# Altium schematic sheet WallLightRemote_V1.0_MCU.SchDoc: WallLight Remote
size A4; PageSetup: Record=PageOptions|CenterHorizontal=True|CenterVertical=True|PrintScale=0.97|XCorrection=1.00|YCorrection=1.00|PrintKind=0|BorderSize=5000000|LeftOffset=0|BottomOffset=0|Orientation=2|PaperLength=1000|PaperWidth=1000|Scale=100|PaperSource=7|PrintQuality=-3|MediaType=1|DitherType=10|PrintScaleMode=1|PaperKind=A4|PaperIndex=9; Organization: Crelin; Address1: Karl-Neuhaus-Strasse 6, 2502 Biel; Address2: Florian Baumgartner; Address3: florian.b-h@bluewin.ch; Address4: Tel: (+41) 32-323 56 25 / (+41) 79-502 92 10; DocumentNumber: MCU; Revision: V1.0; SheetNumber: 2; SheetTotal: 5; Author: Florian Baumgartner
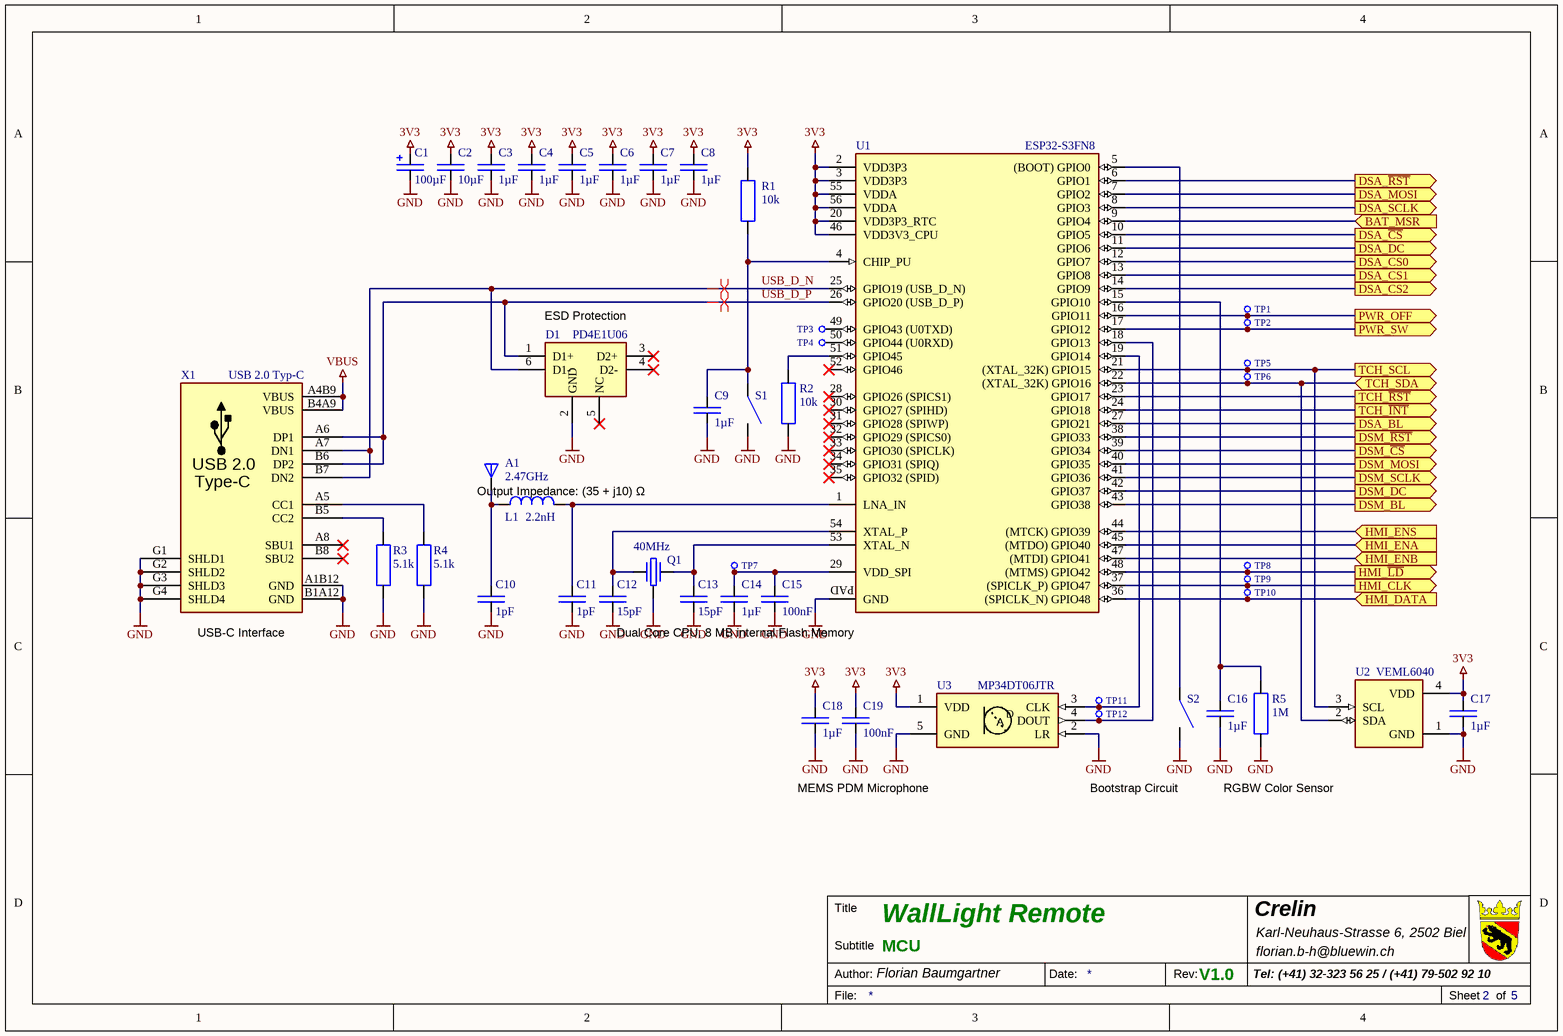
[diagram p0: WallLightRemote_V1.0_MCU.SchDoc]

## Parts
A1  2.47GHz  [SMD Chip-Antenna 7020 (SLDA72-2R470G-S1TF)]
C1  100µF  [SMD Tantalkondensator 1210 +]
C2  10µF  [SMD Keramikkondensator 1206]
C3  1µF  [SMD Keramikkondensator 0603]
C4  1µF  [SMD Keramikkondensator 0603]
C5  1µF  [SMD Keramikkondensator 0603]
C6  1µF  [SMD Keramikkondensator 0603]
C7  1µF  [SMD Keramikkondensator 0603]
C8  1µF  [SMD Keramikkondensator 0603]
C9  1µF  [SMD Keramikkondensator 0603]
C10  1pF  [SMD Keramikkondensator 0402]
C11  1pF  [SMD Keramikkondensator 0402]
C12  15pF  [SMD Keramikkondensator 0603]
C13  15pF  [SMD Keramikkondensator 0603]
C14  1µF  [SMD Keramikkondensator 0603]
C15  100nF  [SMD Keramikkondensator 0603]
C16  1µF  [SMD Keramikkondensator 0603]
C17  1µF  [SMD Keramikkondensator 0603]
C18  1µF  [SMD Keramikkondensator 0603]
C19  100nF  [SMD Keramikkondensator 0603]
D1  PD4E1U06  [SMD IC SOT-363 (SC-70-6)]
L1  2.2nH  [SMD Inductor 0402]
Q1  40MHz  [SMD Crystal 2.5X2.0X0.5]
R1  10k  [SMD Widerstand 0603]
R2  10k  [SMD Widerstand 0603]
R3  5.1k  [SMD Widerstand 0603]
R4  5.1k  [SMD Widerstand 0603]
R5  1M  [SMD Widerstand 0603]
S1  SMD-Button  [SMD Button 4.2x3.2x2.5]  (value not drawn)
S2  SMD-Button  [SMD Button 4.2x3.2x2.5]  (value not drawn)
TP1  X-TP  [SMD Testpunkt Ø1mm]  (value not drawn)  (no BOM)
TP2  X-TP  [SMD Testpunkt Ø1mm]  (value not drawn)  (no BOM)
TP3  X-TP  [SMD Testpunkt Ø1mm]  (value not drawn)  (no BOM)
TP4  X-TP  [SMD Testpunkt Ø1mm]  (value not drawn)  (no BOM)
TP5  X-TP  [SMD Testpunkt Ø1mm]  (value not drawn)  (no BOM)
TP6  X-TP  [SMD Testpunkt Ø1mm]  (value not drawn)  (no BOM)
TP7  X-TP  [SMD Testpunkt Ø1mm]  (value not drawn)  (no BOM)
TP8  X-TP  [SMD Testpunkt Ø1mm]  (value not drawn)  (no BOM)
TP9  X-TP  [SMD Testpunkt Ø1mm]  (value not drawn)  (no BOM)
TP10  X-TP  [SMD Testpunkt Ø1mm]  (value not drawn)  (no BOM)
TP11  X-TP  [SMD Testpunkt Ø1mm]  (value not drawn)  (no BOM)
TP12  X-TP  [SMD Testpunkt Ø1mm]  (value not drawn)  (no BOM)
U1  ESP32-S3FN8  [SMD IC QFN-56 (0.4mm)]
U2  VEML6040  [SMD Color Sensor (VEML6040)]
U3  MP34DT06JTR  [SMD Microphone (MP34DT06JTR)]
X1  USB 2.0 Typ-C  [SMD USB-C Socket (A40-00119)]

## Ports
BAT_MSR (in), DSA_BL (out), DSA_CS0 (out), DSA_CS1 (out), DSA_CS2 (out), DSA_DC (out), DSA_MOSI (out), DSA_SCLK (out), DSA_~{CS} (out), DSA_~{RST} (out), DSM_BL (out), DSM_DC (out), DSM_MOSI (out), DSM_SCLK (out), DSM_~{CS} (out), DSM_~{RST} (out), HMI_CLK (out), HMI_DATA (in), HMI_ENA (in), HMI_ENB (in), HMI_ENS (in), HMI_~{LD} (out), PWR_OFF (out), PWR_SW (out), TCH_SCL (out), TCH_SDA (bidir), TCH_~{INT} (out), TCH_~{RST} (out)

## Nets
3V3: C1.P(+) C2.2 C3.2 C4.2 C5.2 C6.2 C7.2 C8.2 C17.2 C18.2 C19.2 R1.2 U1.2(VDD3P3) U1.3(VDD3P3) U1.20(VDD3P3_RTC) U1.46(VDD3V3_CPU) U1.55(VDDA) U1.56(VDDA) U2.4(VDD) U3.1(VDD)
GND: C1.M(-) C2.1 C3.1 C4.1 C5.1 C6.1 C7.1 C8.1 C9.1 C10.2 C11.2 C12.2 C13.2 C14.1 C15.1 C16.1 C17.1 C18.1 C19.1 D1.2(GND) Q1.3 R2.1 R3.2 R4.2 R5.1 S1.2 S2.2 U1.PAD(GND) U2.1(GND) U3.2(LR) U3.5(GND) X1.A1B12(GND) X1.B1A12(GND) X1.G1(SHLD1) X1.G2(SHLD2) X1.G3(SHLD3) X1.G4(SHLD4)
VBUS: X1.A4B9(VBUS) X1.B4A9(VBUS)
BAT_MSR: U1.9(GPIO4) ; port BAT_MSR
DSA_BL: U1.27(GPIO21) ; port DSA_BL
DSA_~{CS}: U1.10(GPIO5) ; port DSA_~{CS}
DSA_CS0: U1.12(GPIO7) ; port DSA_CS0
DSA_CS1: U1.13(GPIO8) ; port DSA_CS1
DSA_CS2: U1.14(GPIO9) ; port DSA_CS2
DSA_DC: U1.11(GPIO6) ; port DSA_DC
DSA_MOSI: U1.7(GPIO2) ; port DSA_MOSI
DSA_~{RST}: U1.6(GPIO1) ; port DSA_~{RST}
DSA_SCLK: U1.8(GPIO3) ; port DSA_SCLK
DSM_BL: U1.43(GPIO38) ; port DSM_BL
DSM_~{CS}: U1.39(GPIO34) ; port DSM_~{CS}
DSM_DC: U1.42(GPIO37) ; port DSM_DC
DSM_MOSI: U1.40(GPIO35) ; port DSM_MOSI
DSM_~{RST}: U1.38(GPIO33) ; port DSM_~{RST}
DSM_SCLK: U1.41(GPIO36) ; port DSM_SCLK
HMI_CLK: TP9.1 U1.37((SPICLK_P)_GPIO47) ; port HMI_CLK
HMI_DATA: TP10.1 U1.36((SPICLK_N)_GPIO48) ; port HMI_DATA
HMI_ENA: U1.45((MTDO)_GPIO40) ; port HMI_ENA
HMI_ENB: U1.47((MTDI)_GPIO41) ; port HMI_ENB
HMI_ENS: U1.44((MTCK)_GPIO39) ; port HMI_ENS
HMI_~{LD}: TP8.1 U1.48((MTMS)_GPIO42) ; port HMI_~{LD}
PWR_OFF: TP1.1 U1.16(GPIO11) ; port PWR_OFF
PWR_SW: TP2.1 U1.17(GPIO12) ; port PWR_SW
TCH_~{INT}: U1.24(GPIO18) ; port TCH_~{INT}
TCH_~{RST}: U1.23(GPIO17) ; port TCH_~{RST}
TCH_SCL: TP5.1 U1.21((XTAL_32K)_GPIO15) U2.3(SCL) ; port TCH_SCL
TCH_SDA: TP6.1 U1.22((XTAL_32K)_GPIO16) U2.2(SDA) ; port TCH_SDA
USB_D_N: D1.6(D1-) U1.25(GPIO19_(USB_D_N)) X1.A7(DN1) X1.B7(DN2)
USB_D_P: D1.1(D1+) U1.26(GPIO20_(USB_D_P)) X1.A6(DP1) X1.B6(DP2)
NetA1_1: A1.1 C10.1 L1.1
NetC9_2: C9.2 R1.1 S1.1 U1.4(CHIP_PU)
NetC11_1: C11.1 L1.2 U1.1(LNA_IN)
NetC12_1: C12.1 Q1.1 U1.54(XTAL_P)
NetC13_1: C13.1 Q1.2 U1.53(XTAL_N)
NetC14_2: C14.2 C15.2 TP7.1 U1.29(VDD_SPI)
NetC16_2: C16.2 R5.2 U1.15(GPIO10)
NetR2_2: R2.2 U1.51(GPIO45)
NetR3_1: R3.1 X1.B5(CC2)
NetR4_1: R4.1 X1.A5(CC1)
NetS2_1: S2.1 U1.5((BOOT)_GPIO0)
NetTP3_1: TP3.1 U1.49(GPIO43_(U0TXD))
NetTP4_1: TP4.1 U1.50(GPIO44_(U0RXD))
NetTP11_1: TP11.1 U1.19(GPIO14) U3.3(CLK)
NetTP12_1: TP12.1 U1.18(GPIO13) U3.4(DOUT)

Not connected (* = marked no-connect by the designer): D1 3(D2+)* 4(D2-)* 5(NC)*; U1 28(GPIO26_(SPICS1))* 30(GPIO27_(SPIHD))* 31(GPIO28_(SPIWP))* 32(GPIO29_(SPICS0))* 33(GPIO30_(SPICLK))* 34(GPIO31_(SPIQ))* 35(GPIO32_(SPID))* 52(GPIO46)*; X1 A8(SBU1)* B8(SBU2)*

## Layout directives
differential pair: USB_D_N, USB_D_P

## Notes on the sheet
- (near D1) ESD Protection
- (near U1) Output Impedance: (35 + j10) Ω
- (near X1) USB-C Interface
- (near U1) Dual Core CPU, 8 MB internal Flash Memory
- (near U3) MEMS PDM Microphone
- Bootstrap Circuit
- RGBW Color Sensor
- Title
- Crelin
- Author:
- Subtitle
- Date:
- Rev:
- File:
- Sheet
- of
- (in symbol U-MP34DT06JTR) D; A
- (in symbol X-USB-Buchse) USB 2.0; Type-C

## Library data of the parts
A1 = A-Chip-Antenna: Chip-Antenna; Component Value: SLDA72-2R470G-S1TF (2.47GHz); Digikey: 3442-SLDA72-2R470G-S1TFTR-ND; Component Description: Chip-Antenna; ComponentLink1Description: Datasheet; ComponentLink1URL: https://datasheet.lcsc.com/lcsc/2110081530_Sunlord-SLDA72-2R470G-S1TF_C370399.pdf; JLC-Parts: C370399; Unit Price: 0.20
C1 = C-ELCAP: CAP-Elko; Component Description: Tantalum Capacitor; Component Value: 100µF 6.3V; Digikey: 478-1677-1-ND; Farnell: 1135048; Mouser: 581-TAJB107K006R; JLC-Parts: C16133; Unit Price: 0.08
C2 = E6 - 10uF: SMD Ceramic Capacitor E6; Component Value: 10µF 50V; Component Description: Multilayer Ceramic Capacitors MLCC; ComponentLink1Description: Datasheet; ComponentLink1URL: https://datasheet.lcsc.com/lcsc/1810191219_Samsung-Electro-Mechanics-CL10A106KP8NNNC_C19702.pdf; Digikey: 587-3258-1-ND; Farnell: 2113070; JLC-Parts: C13585; Mouser: 963-LMK107BBJ106MALT; Unit Price: 0.01
C3-C9 C14 C16-C18 = C-CAPACITOR: CAP-MK; Component Description: Multilayer Ceramic Capacitors; Component Value: 1µF 50V; Digikey: 1276-1860-1-ND; Farnell: 3013383; Mouser: 187-CL10A105KB8NNNC; JLC-Parts: C15849; Unit Price: 0.01
C10 C11 = C-CAPACITOR: CAP-MK; Component Description: Multilayer Ceramic Capacitors; Component Value: 1pF 50V; Digikey: 490-13288-1-ND; Farnell: 3581492; Mouser: 81-GCM1555C1H1R0CA6D; JLC-Parts: C161149; Unit Price: 0.01
C12 C13 = C-CAPACITOR: CAP-MK; Component Description: Multilayer Ceramic Capacitors; Component Value: 15pF 50V; Digikey: 399-C0603C150J5GAC7867CT-ND; Farnell: 1414614; Mouser: 80-C0603C150J5G; JLC-Parts: C1644; Unit Price: 0.01
C15 C19 = E6 - 100nF: SMD Ceramic Capacitor E6; Component Value: 100nF 50V; Component Description: Multilayer Ceramic Capacitors MLCC; ComponentLink1Description: Datasheet; ComponentLink1URL: https://datasheet.lcsc.com/lcsc/1809301912_YAGEO-CC0603KRX7R9BB104_C14663.pdf; Digikey: 445-6899-1-ND; Farnell: 2210822; JLC-Parts: C14663; Mouser: 810-CGA2B3X7R1H104K; Unit Price: 0.01
D1 = PD4E1U06DCKR: Unidirectional 3A (8/20us) 15V (Typ) 6.5V 5.5V (Max) SOT-363 ESD Protection Devices ROHS; Component Description: ESD Suppressor; ComponentLink1Description: Datasheet; ComponentLink1URL: https://datasheet.lcsc.com/lcsc/1810172210_Texas-Instruments-TPD4E1U06DCKR_C194628.pdf; Component Value: PD4E1U06; Digikey: 296-39347-1-ND; Farnell: 3116516; JLC-Parts: C194628; Mouser: 595-TPD4E1U06DCKR; Unit Price: 0.12
L1 = R-COIL (HF): Chip Inductor; Farnell: 1343064; Mouser: 81-LQG15HN2N2S02D; Digikey: 490-1077-1-ND; Component Description: Chip Inductor; Component Value: 2.2nH; JLC-Parts: C918998; Unit Price: 0.01
Q1 = B-QUARZ-CAP: Component Description: Crystal; Digikey: XC2730CT-ND; Farnell: 4059221; Mouser: 520-400-8-36Q-CWYT; ComponentLink1Description: Datasheet; ComponentLink1URL: https://ecsxtal.com/store/pdf/ECX-2236Q.pdf; Component Value: 40Mhz; JLC-Parts: C524681; Unit Price: 0.16
R1 R2 = R-RESISTOR: RES (E=Heizwiderstand B=Messwandler); Component Description: Thick Film Chip Resistor; Component Value: 10k (75V, 100mW, 1%); Digikey: P10.0KHCT-ND; Farnell: 2303192; Mouser: 667-ERJ-3EKF1002V; JLC-Parts: C25804; Unit Price: 0.01
R3 R4 = R-RESISTOR: RES (E=Heizwiderstand B=Messwandler); Component Description: Thick Film Chip Resistor; Component Value: 5.1k (75V, 100mW, 1%); Digikey: P5.10KHCT-ND; Farnell: 2059378; Mouser: 667-ERJ-3EKF5101V; JLC-Parts: C23186; Unit Price: 0.01
R5 = R-RESISTOR: RES (E=Heizwiderstand B=Messwandler); Component Description: Thick Film Chip Resistor; Component Value: 1M (75V, 100mW, 1%); Digikey: P1.00MHCT-ND; Farnell: 2303325; Mouser: 667-ERJ-3EKF1004V; ComponentLink1Description: Datasheet; ComponentLink1URL: https://datasheet.lcsc.com/lcsc/1810200710_UNI-ROYAL-Uniroyal-Elec-0603WAF4701T5E_C23162.pdf; JLC-Parts: C22935; Unit Price: 0.01
S1 S2 = Button 3mmx2.5mm: Button SPST; Component Value: SKRPACE010; Component Description: Tactile Switch; Digikey: 4809-SKRPACE010CT-ND; ComponentLink1Description: Datasheet; Farnell: 3261825; JLC-Parts: C139797; Mouser: 688-SKRPACE010; Unit Price: 0.04
  S1: ComponentLink1URL: https://datasheet.lcsc.com/lcsc/1811051610_ALPSALPINE-SKRPACE010_C139797.pdf
  S2: ComponentLink1URL: https://datasheet.lcsc.com/lcsc/1912111437_PANASONIC-EVQQ2U02W_C395227.pdf
TP1-TP12 = X-TP: Testpunkt; Component Value: Ø 0.8mm; Component Description: Testpunkt; Unit Price: 0.00
U1 = U-ESP32-S3FN8: 2.4 GHz Wi­Fi + Bluetooth® LE SoC; aliExpress: 1005004891428522; Mouser: 356-ESP32-S3FN8; ComponentLink1Description: Datasheet; ComponentLink1URL: https://www.mouser.ch/datasheet/2/891/esp32_s3_datasheet_en-2946743.pdf; Component Description: 2.4 GHz Wi­Fi + Bluetooth® LE SoC; Component Value: ESP32-S3FN8; Unit Price: 1.92
U2 = U-VEML6040: RGBW Color Sensor with I2C Interface; Digikey: VEML6040A3OGDKR-ND; Farnell: 2504135; Mouser: 78-VEML6040A3OG; ComponentLink1Description: Datasheet; ComponentLink1URL: https://www.vishay.com/docs/84276/veml6040.pdf; Component Description: RGBW Color Sensor with I2C Interface; Component Value: VEML6040; JLC-Parts: C78465; Unit Price: 0.83
U3 = U-MP34DT06JTR: Digital PDM MEMS Microphone; Digikey: 497-18180-1-ND; Farnell: 2980885; Mouser: 511-MP34DT06JTR; ComponentLink1Description: Datasheet; ComponentLink1URL: https://datasheet.lcsc.com/lcsc/2004071606_STMicroelectronics-MP34DT06JTR_C503097.pdf; Component Description: Digital PDM MEMS Microphone; Component Value: MP34DT06JTR; JLC-Parts: C503097; Unit Price: 2.18
X1 = X-USB-Buchse: Typ-C; aliExpress: 33045191307; Component Description: USB Connector Type-C; Component Value: USB4105-GF-A; Digikey: 2073-USB4105-GF-ACT-ND; Farnell: 3583366; ComponentLink1Description: Datasheet; ComponentLink1URL: https://datasheet.lcsc.com/lcsc/2103051833_Jing-Extension-of-the-Electronic-Co--918-418K2023S40001_C167321.pdf; JLC-Parts: C167321; Unit Price: 0.34